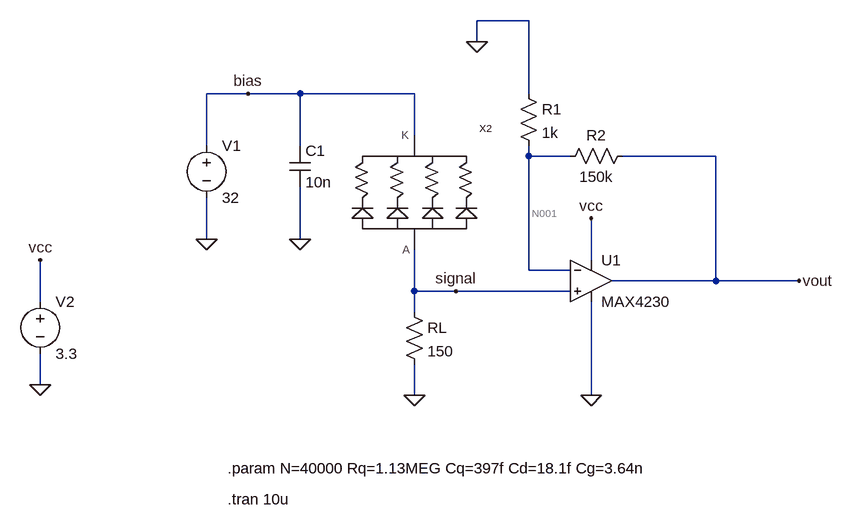
[diagram p0: schematic voltagemode.asc]
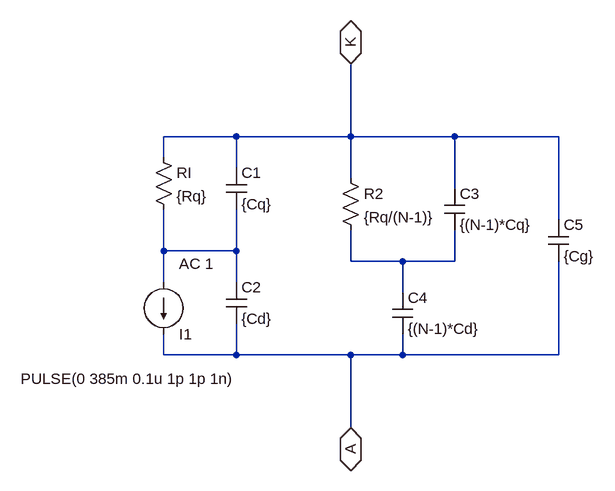
[diagram p1: sub-circuit sipm_equivalente_controllo_tensione_pulse.asc]
voltagemode.asc, the LTspice schematic file:
Version 4.1
SHEET 1 1076 680
WIRE 304 -128 224 -128
WIRE 224 -96 224 -128
WIRE -128 -16 -192 -16
WIRE -48 -16 -128 -16
WIRE 128 -16 -48 -16
WIRE 304 -16 304 -128
WIRE 128 48 128 -16
WIRE -192 64 -192 -16
WIRE -48 64 -48 -16
WIRE 304 80 304 64
WIRE 368 80 304 80
WIRE 592 80 448 80
WIRE -192 208 -192 144
WIRE -48 208 -48 128
WIRE 400 240 400 176
WIRE 304 256 304 80
WIRE 368 256 304 256
WIRE 592 272 592 80
WIRE 592 272 432 272
WIRE 720 272 592 272
WIRE 128 288 128 224
WIRE 192 288 128 288
WIRE 368 288 192 288
WIRE -448 304 -448 240
WIRE 128 320 128 288
WIRE -448 432 -448 384
WIRE 128 448 128 400
WIRE 400 448 400 304
FLAG -192 208 0
FLAG -48 208 0
FLAG 128 448 0
FLAG 400 448 0
FLAG -448 432 0
FLAG -448 240 vcc
FLAG 400 176 vcc
FLAG 720 272 vout
FLAG 224 -96 0
FLAG 192 288 signal
FLAG -128 -16 bias
SYMBOL voltage -192 48 R0
SYMATTR InstName V1
SYMATTR Value 32
SYMBOL cap -64 64 R0
SYMATTR InstName C1
SYMATTR Value 10n
SYMBOL res 112 304 R0
SYMATTR InstName RL
SYMATTR Value 150
SYMBOL OpAmps\\MAX4230 400 208 R0
SYMATTR InstName U1
SYMBOL voltage -448 288 R0
SYMATTR InstName V2
SYMATTR Value 3.3
SYMBOL res 288 -32 R0
SYMATTR InstName R1
SYMATTR Value 1k
SYMBOL res 464 64 R90
WINDOW 0 0 56 VBottom 2
WINDOW 3 32 56 VTop 2
SYMATTR InstName R2
SYMATTR Value 150k
SYMBOL sipm_equivalente_controllo_tensione_pulse 128 128 R0
SYMATTR InstName X2
TEXT -160 560 Left 2 !.param N=40000 Rq=1.13MEG Cq=397f Cd=18.1f Cg=3.64n
TEXT -160 608 Left 2 !.tran 10u

sipm_equivalente_controllo_tensione_pulse.asc, the sub-circuit schematic file:
Version 4.1
SHEET 1 3028 692
WIRE 80 16 -32 16
WIRE 256 16 256 -96
WIRE 256 16 80 16
WIRE 416 16 256 16
WIRE 576 16 416 16
WIRE -32 48 -32 16
WIRE 80 64 80 16
WIRE 256 80 256 16
WIRE 416 96 416 16
WIRE 576 144 576 16
WIRE -32 192 -32 128
WIRE 80 192 80 128
WIRE 80 192 -32 192
WIRE 256 208 256 160
WIRE 336 208 256 208
WIRE 416 208 416 160
WIRE 416 208 336 208
WIRE -32 240 -32 192
WIRE 80 240 80 192
WIRE 336 256 336 208
WIRE -32 352 -32 320
WIRE 80 352 80 304
WIRE 80 352 -32 352
WIRE 256 352 80 352
WIRE 336 352 336 320
WIRE 336 352 256 352
WIRE 576 352 576 208
WIRE 576 352 336 352
WIRE 256 464 256 352
FLAG 256 464 A
IOPIN 256 464 BiDir
FLAG 256 -96 K
IOPIN 256 -96 BiDir
SYMBOL res -48 32 R0
SYMATTR InstName RI
SYMATTR Value {Rq}
SYMBOL res 240 64 R0
SYMATTR InstName R2
SYMATTR Value {Rq/(N-1)}
SYMBOL cap 64 64 R0
SYMATTR InstName C1
SYMATTR Value {Cq}
SYMBOL cap 64 240 R0
SYMATTR InstName C2
SYMATTR Value {Cd}
SYMBOL cap 400 96 R0
SYMATTR InstName C3
SYMATTR Value {(N-1)*Cq}
SYMBOL cap 320 256 R0
SYMATTR InstName C4
SYMATTR Value {(N-1)*Cd}
SYMBOL cap 560 144 R0
SYMATTR InstName C5
SYMATTR Value {Cg}
SYMBOL current -32 240 R0
WINDOW 0 24 80 Left 2
WINDOW 3 -220 149 Left 2
WINDOW 123 24 -28 Left 2
WINDOW 39 0 0 Left 2
SYMATTR InstName I1
SYMATTR Value PULSE(0 385m 0.1u 1p 1p 1n)
SYMATTR Value2 AC 1

The netlist it stands for:
* voltagemode.asc
V1 bias 0 32
C1 bias 0 10n
RL signal 0 150
X§U1 signal N001 vcc 0 vout MAX4230  ; pins In+ In- V+ V- OUT
V2 vcc 0 3.3
R1 0 N001 1k
R2 vout N001 150k
X§X2 bias signal sipm_equivalente_controllo_tensione_pulse

* block symbol definitions
.subckt sipm_equivalente_controllo_tensione_pulse K A
RI K N001 {Rq}
R2 K N002 {Rq/(N-1)}
C1 K N001 {Cq}
C2 N001 A {Cd}
C3 K N002 {(N-1)*Cq}
C4 N002 A {(N-1)*Cd}
C5 K A {Cg}
I1 N001 A PULSE(0 385m 0.1u 1p 1p 1n) AC 1
.ends sipm_equivalente_controllo_tensione_pulse

.param N=40000 Rq=1.13MEG Cq=397f Cd=18.1f Cg=3.64n
.tran 10u
.lib MAX4230.lib
.backanno
.end

* Results of the author's LTspice run, read from the files saved beside the schematic
* Operating Point, zero values left out:
*   V(bias) = 32 V
*   V(n001) = 1.169 mV
*   V(vcc) = 3.3 V
*   V(vout) = 176.5 mV
*   I(R1) = -1.169 µA
*   I(R2) = 1.169 µA
*   I(RL) = -25.55 pA
*   I(V2) = -1.097 mA
*   Ix(u1:1) = 25.55 pA
*   Ix(u1:2) = -23.28 pA
*   Ix(u1:3) = 1.097 mA
*   Ix(u1:4) = -1.096 mA
*   Ix(u1:5) = -1.169 µA
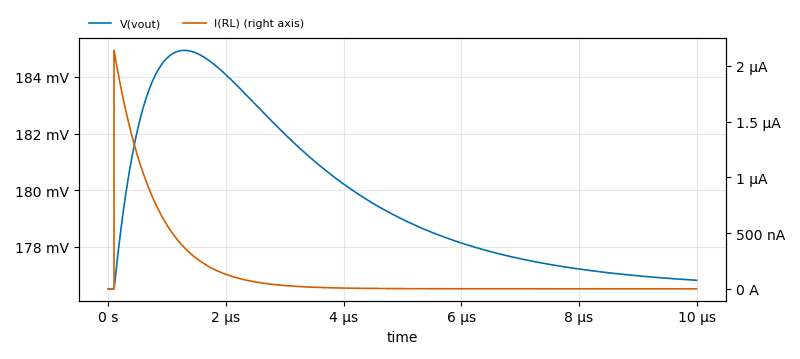
[diagram p2: Transient Analysis of voltagemode.asc, plotted from the saved traces]
* Transient Analysis, 1 run:
*   V(vout): min 176.5 mV, max 184.9 mV, average 179.7 mV, rms 179.8 mV, last 176.8 mV
*   I(RL): min -25.55 pA, max 2.139 µA, average 145.6 nA, rms 395.4 nA, last -24.74 pA